# Altium schematic sheet sch_LIMA_Driver.SchDoc
size A4
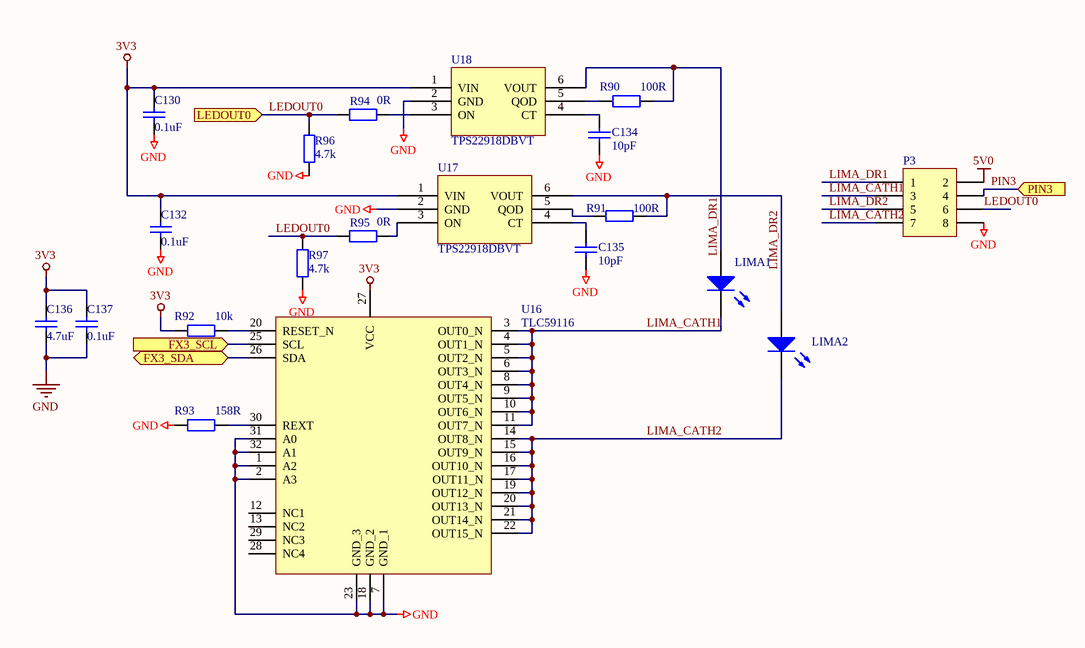
[diagram p0: sch_LIMA_Driver.SchDoc]

## Parts
C130  value 0.1uF  [0402C_L]  (hidden comment: 1uF)
C132  value 0.1uF  [0402C_L]  (hidden comment: 1uF)
C134  10pF  [0402C_L]
C135  10pF  [0402C_L]
C136  4.7uF
C137  0.1uF  [0402C]
LIMA1  LIMA  (value not drawn)
LIMA2  LIMA  (value not drawn)
P3  Header 4X2  [HDR2X4]  (value not drawn)
R90  100R  [0402R]
R91  100R  [0402R]
R92  10k  [0402R]
R93  158R  [0402R]
R94  0R  [0402R]
R95  0R  [0402R]
R96  4.7k  [0402R]
R97  4.7k  [0402R]
U16  TLC59116
U17  TPS22918DBVT
U18  TPS22918DBVT

## Ports
FX3_SCL (in), FX3_SDA (bidir), LEDOUT0 (in), PIN3 (in)

## Nets
3V3: C130.2 C132.2 C136.2 C137.2 R92.2 U16.27(VCC) U17.1(VIN) U18.1(VIN)
5V0: P3.2
GND: C130.1 C132.1 C134.1 C135.1 C136.1 C137.1 P3.8 R93.2 R96.1 R97.1 U16.1(A2) U16.2(A3) U16.7(GND_1) U16.18(GND_2) U16.23(GND_3) U16.31(A0) U16.32(A1) U17.2(GND) U18.2(GND)
FX3_SCL: U16.25(SCL) ; port FX3_SCL
FX3_SDA: U16.26(SDA) ; port FX3_SDA
LEDOUT0: P3.6 R94.2 R95.2 R96.2 R97.2 ; port LEDOUT0
LIMA_CATH1: LIMA1.2(K) P3.3 U16.3(OUT0_N) U16.4(OUT1_N) U16.5(OUT2_N) U16.6(OUT3_N) U16.8(OUT4_N) U16.9(OUT5_N) U16.10(OUT6_N) U16.11(OUT7_N)
LIMA_CATH2: LIMA2.2(K) P3.7 U16.14(OUT8_N) U16.15(OUT9_N) U16.16(OUT10_N) U16.17(OUT11_N) U16.19(OUT12_N) U16.20(OUT13_N) U16.21(OUT14_N) U16.22(OUT15_N)
LIMA_DR1: P3.1
LIMA_DR2: LIMA2.1(A) P3.5 R91.1 U17.6(VOUT)
PIN3: P3.4 ; port PIN3
NetC134_2: C134.2 U18.4(CT)
NetC135_2: C135.2 U17.4(CT)
NetLIMA1_1: LIMA1.1(A) R90.1 U18.6(VOUT)
NetR90_2: R90.2 U18.5(QOD)
NetR91_2: R91.2 U17.5(QOD)
NetR92_1: R92.1 U16.20(RESET_N)
NetR93_1: R93.1 U16.30(REXT)
NetR94_1: R94.1 U18.3(ON)
NetR95_1: R95.1 U17.3(ON)

Not connected (* = marked no-connect by the designer): U16 12(NC1) 13(NC2) 28(NC4) 29(NC3)

## Notes on the sheet
- Labels drawn without touching a wire or pin: LIMA_DR1

## Library data of the parts
C130 C132 C134 C135 = Cap: Capacitor; Published: 8-Jun-2000; LatestRevisionDate: 17-Jul-2002; LatestRevisionNote: Re-released for DXP Platform.; Publisher: Altium Limited
  C134 C135: Value: 10pF
C136 = Cap: Capacitor; Value: 0805; Published: 8-Jun-2000; LatestRevisionDate: 17-Jul-2002; LatestRevisionNote: Re-released for DXP Platform.; PackageReference: RAD-0.3; Publisher: Altium Limited
C137 = Cap: Capacitor; Value: C0402; Published: 8-Jun-2000; LatestRevisionDate: 17-Jul-2002; LatestRevisionNote: Re-released for DXP Platform.; Publisher: Altium Limited
LIMA1 LIMA2 = LED: 发光二级管
P3 = Header 4X2: Header, 4-Pin, Dual row; LatestRevisionDate: 17-Jul-2002; LatestRevisionNote: Re-released for DXP Platform.; Publisher: Altium Limited
R90-R97 = Resistor: Value: 100; Published: 8-Jun-2000; LatestRevisionDate: 17-Jul-2002; LatestRevisionNote: Re-released for DXP Platform.; PackageReference: AXIAL-0.4; Publisher: Altium Limited